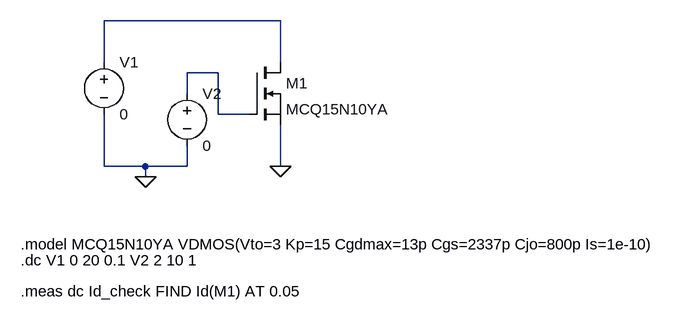
[diagram p0: schematic MCQ15N10YA.asc]
MCQ15N10YA.asc, the LTspice schematic file:
Version 4.1
SHEET 1 948 680
WIRE 176 64 -96 64
WIRE -96 128 -96 64
WIRE 176 128 176 64
WIRE 80 144 32 144
WIRE 32 176 32 144
WIRE 80 208 80 144
WIRE 128 208 80 208
WIRE -96 288 -96 208
WIRE -32 288 -96 288
WIRE 32 288 32 256
WIRE 32 288 -32 288
WIRE 176 288 176 224
WIRE -32 304 -32 288
FLAG -32 304 0
FLAG 176 288 0
SYMBOL nmos 128 128 R0
SYMATTR InstName M1
SYMATTR Value MCQ15N10YA
SYMBOL voltage -96 112 R0
WINDOW 123 0 0 Left 0
WINDOW 39 0 0 Left 0
SYMATTR InstName V1
SYMATTR Value 0
SYMBOL voltage 32 160 R0
SYMATTR InstName V2
SYMATTR Value 0
TEXT -224 408 Left 2 !.model MCQ15N10YA VDMOS(Vto=3 Kp=15 Cgdmax=13p Cgs=2337p Cjo=800p Is=1e-10)
TEXT -224 432 Left 2 !.dc V1 0 20 0.1 V2 2 10 1
TEXT -224 480 Left 2 !.meas dc Id_check FIND Id(M1) AT 0.05

The netlist it stands for:
* MCQ15N10YA.asc
M1 N001 N002 0 0 MCQ15N10YA
V1 N001 0 0
V2 N002 0 0
.model NMOS NMOS
.model PMOS PMOS
.lib standard.mos
.model MCQ15N10YA VDMOS(Vto=3 Kp=15 Cgdmax=13p Cgs=2337p Cjo=800p Is=1e-10)
.dc V1 0 20 0.1 V2 2 10 1
.meas dc Id_check FIND Id(M1) AT 0.05
.backanno
.end